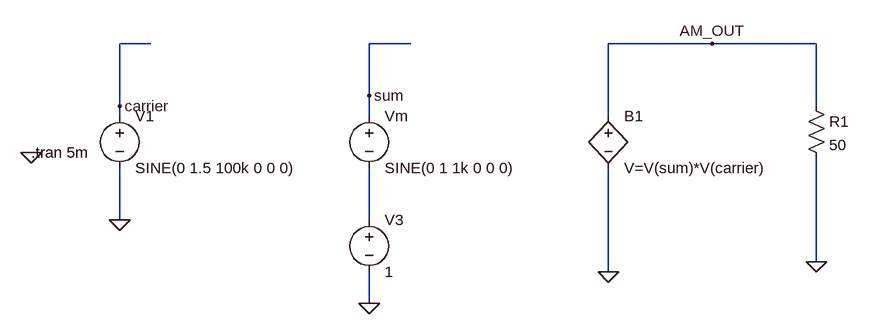
[diagram p0: schematic Q4,5,6 AM critical under over.asc]
Q4,5,6 AM critical under over.asc, the LTspice schematic file:
Version 4
SHEET 1 1256 680
WIRE 176 -16 128 -16
WIRE 576 -16 512 -16
WIRE 1040 -16 880 -16
WIRE 1200 -16 1040 -16
WIRE 512 64 512 -16
WIRE 128 80 128 -16
WIRE 1200 80 1200 -16
WIRE 128 96 128 80
WIRE 512 96 512 64
WIRE 880 96 880 -16
WIRE 128 256 128 176
WIRE 512 256 512 176
WIRE 1200 320 1200 160
WIRE 880 336 880 176
WIRE 512 384 512 336
FLAG 128 256 0
FLAG 128 80 carrier
FLAG 512 384 0
FLAG 512 64 sum
FLAG 880 336 0
FLAG 1200 320 0
FLAG -8 152 0
FLAG 1040 -16 AM_OUT
SYMBOL voltage 128 80 R0
WINDOW 123 0 0 Left 0
WINDOW 39 0 0 Left 0
SYMATTR InstName V1
SYMATTR Value SINE(0 1.5 100k 0 0 0)
SYMBOL voltage 512 80 R0
WINDOW 123 0 0 Left 0
WINDOW 39 0 0 Left 0
SYMATTR InstName Vm
SYMATTR Value SINE(0 1 1k 0 0 0)
SYMBOL voltage 512 240 R0
SYMATTR InstName V3
SYMATTR Value 1
SYMBOL bv 880 80 R0
SYMATTR InstName B1
SYMATTR Value V=V(sum)*V(carrier)
SYMBOL res 1184 64 R0
SYMATTR InstName R1
SYMATTR Value 50
TEXT -8 152 Left 2 !.tran 5m

The netlist it stands for:
* Q4,5,6 AM critical under over.asc
V1 carrier 0 SINE(0 1.5 100k 0 0 0)
Vm sum N001 SINE(0 1 1k 0 0 0)
V3 N001 0 1
B1 AM_OUT 0 V=V(sum)*V(carrier)
R1 AM_OUT 0 50
.tran 5m
.backanno
.end